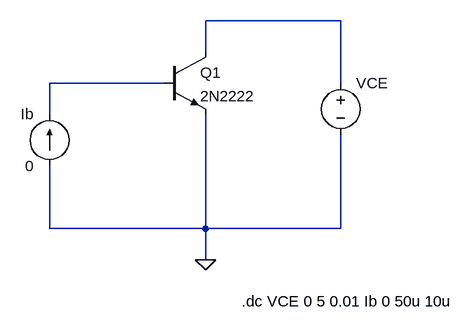
[diagram p0: schematic 11.asc]
11.asc, the LTspice schematic file:
Version 4.1
SHEET 1 880 680
WIRE 368 16 160 16
WIRE 160 64 160 16
WIRE 96 112 -80 112
WIRE 368 112 368 16
WIRE -80 160 -80 112
WIRE -80 336 -80 240
WIRE 160 336 160 160
WIRE 160 336 -80 336
WIRE 368 336 368 192
WIRE 368 336 160 336
WIRE 160 384 160 336
FLAG 160 384 0
SYMBOL voltage 368 96 R0
SYMATTR InstName VCE
SYMATTR Value ""
SYMBOL npn 96 64 R0
SYMATTR InstName Q1
SYMATTR Value 2N2222
SYMBOL current -80 240 R180
WINDOW 0 24 80 Left 2
WINDOW 3 24 0 Left 2
SYMATTR InstName Ib
SYMATTR Value 0
TEXT 216 448 Left 2 !.dc VCE 0 5 0.01 Ib 0 50u 10u

The netlist it stands for:
* 11.asc
VCE N001 0
Q1 N001 N002 0 0 2N2222
Ib 0 N002 0
.model NPN NPN
.model PNP PNP
.lib standard.bjt
.dc VCE 0 5 0.01 Ib 0 50u 10u
.backanno
.end